# EAGLE board IR (EAGLE 9.5.2)
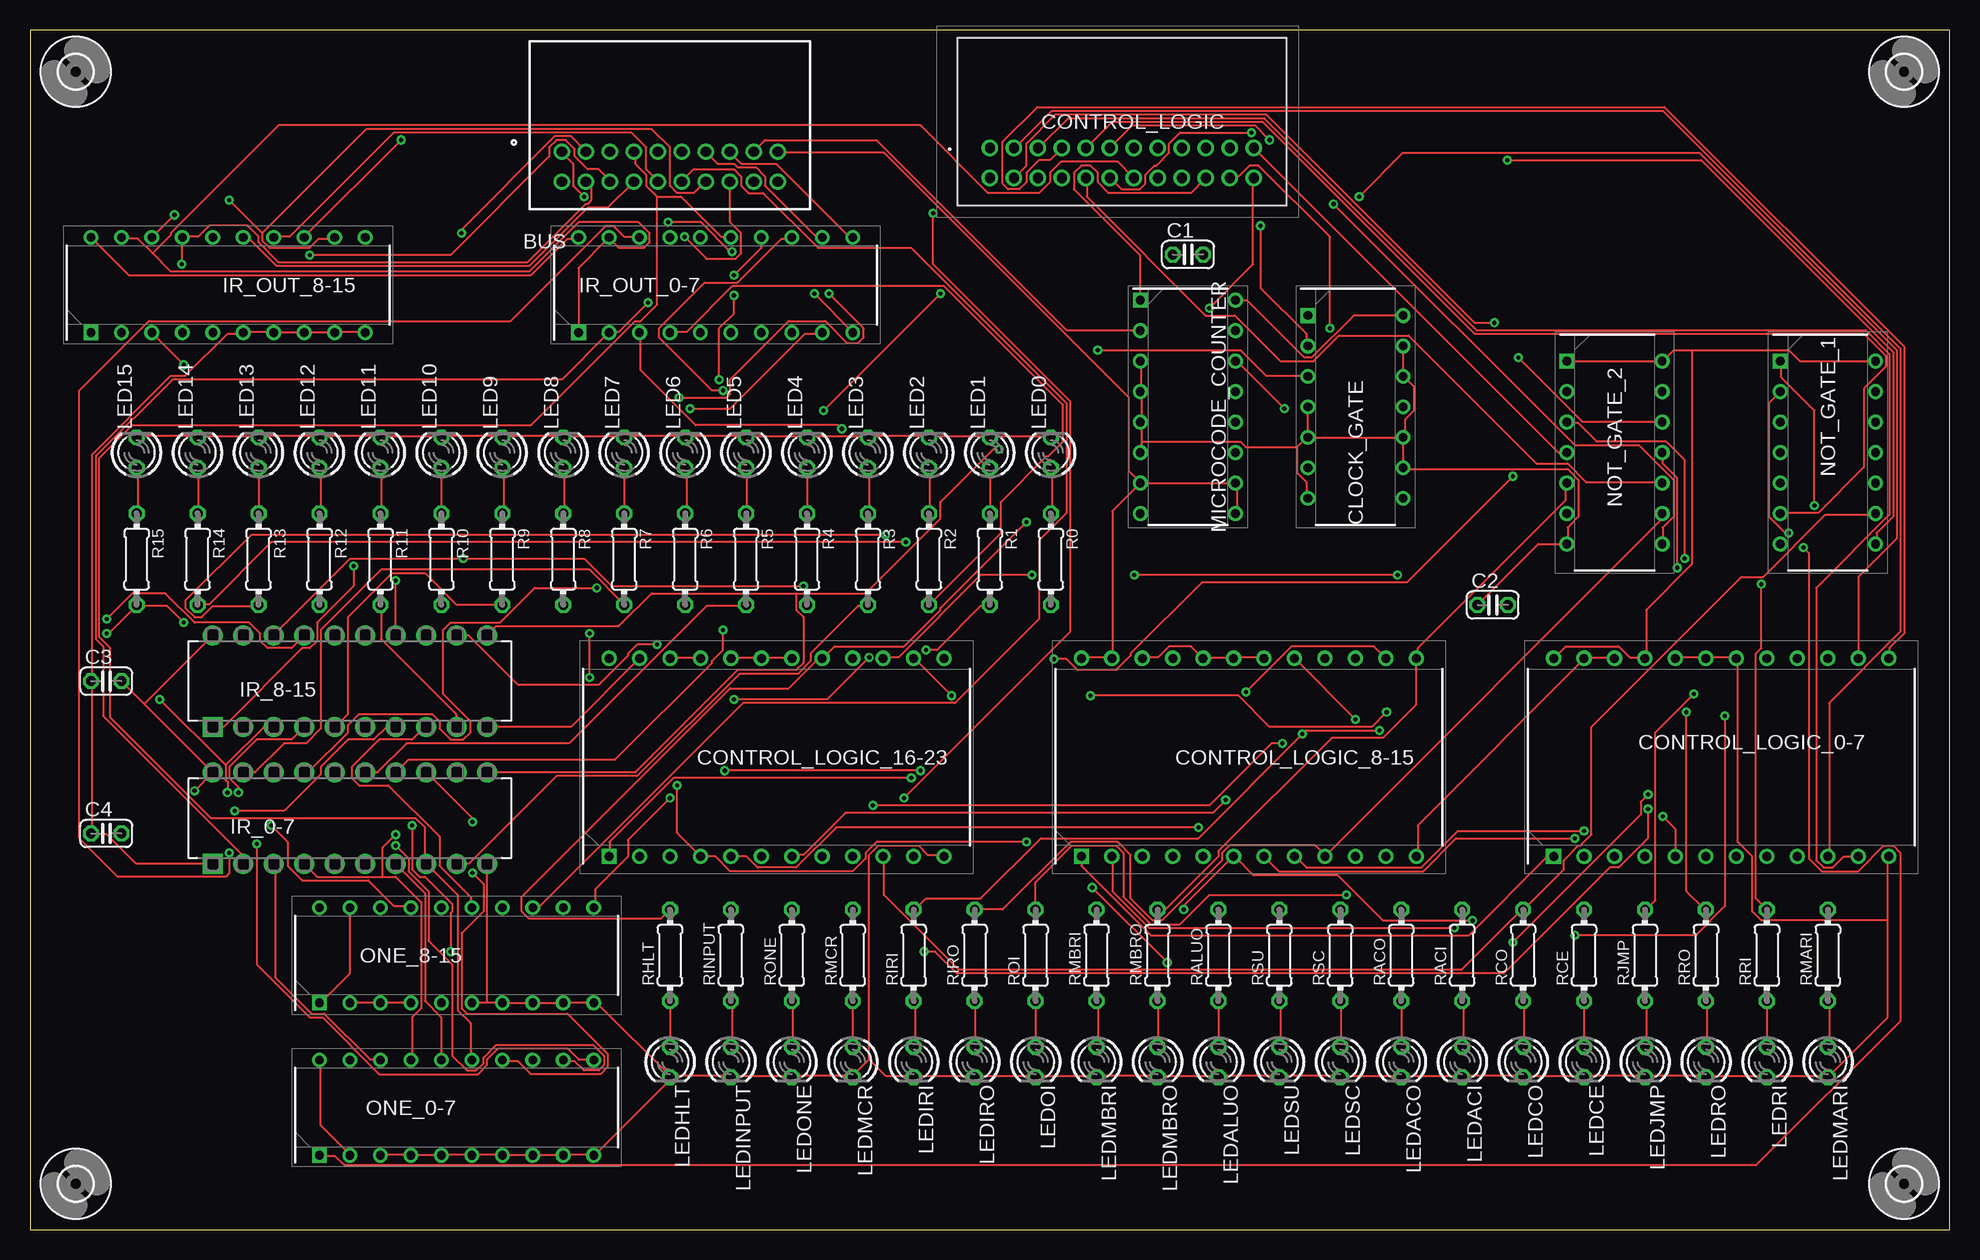
[diagram p1: board, top side]
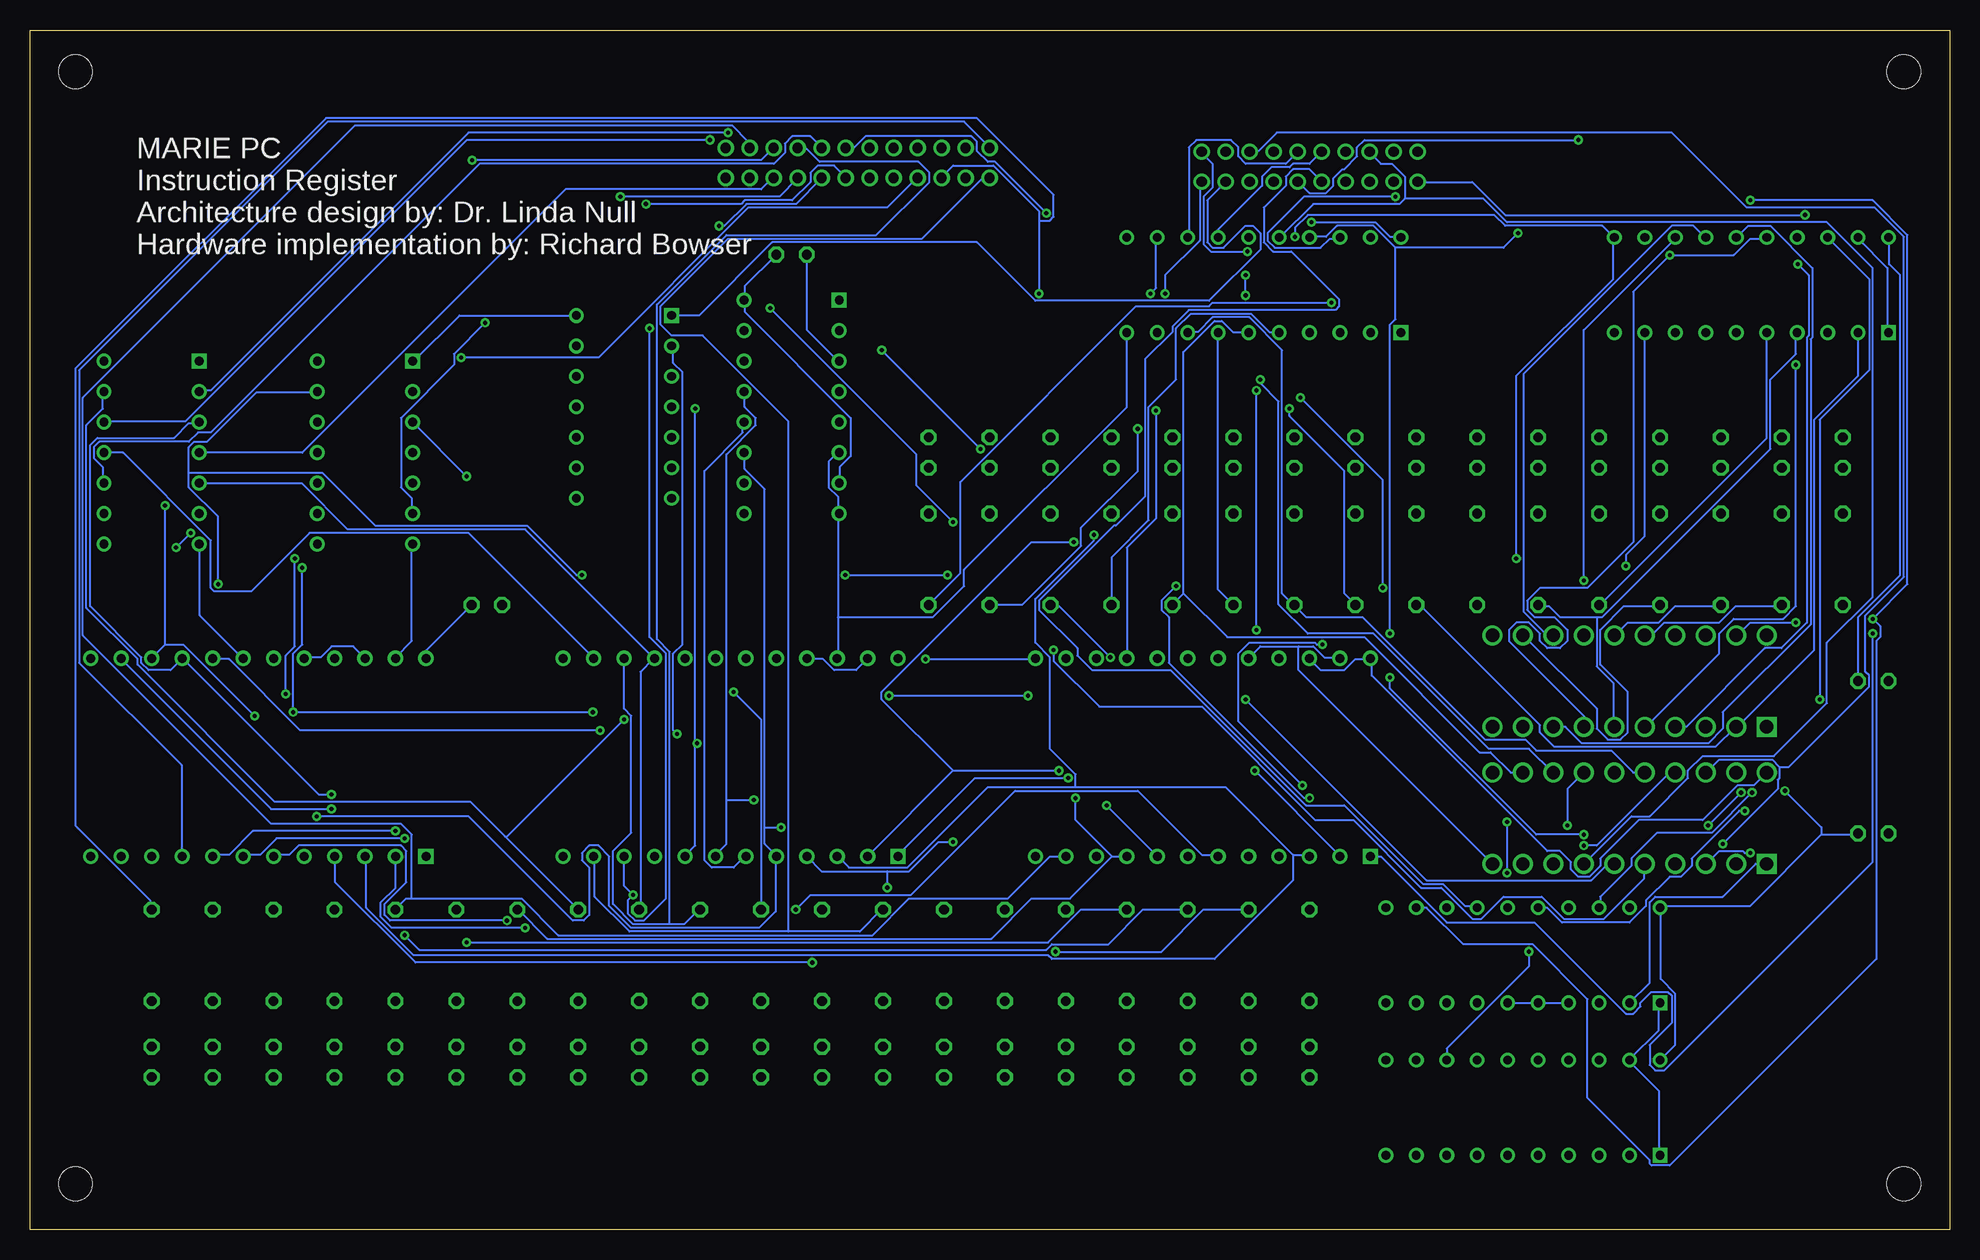
[diagram p2: board, bottom side, seen from below]

Size 160 x 100 mm. Coordinates in mm from the lower left corner, seen from the top.
Outline: 0,0 160,0 160,100 0,100 0,0
Copper layers (1*16): Top 0.035mm / dielectric 1.5mm / Bottom 0.035mm
Design rules "default": minimum track width 6mil, minimum drill 0.35mm, track to track 6mil, track to pad 6mil, pad to pad 6mil, via to via 6mil, smd to smd 6mil, copper to edge 40mil, drill to drill 6mil, minimum pad ring 10mil, minimum via ring 8mil, stop-mask expansion 4mil, vias tented up to drill 0mil, thermal gap 10mil

## Footprints (pad centres in the part's own frame; a part is rotated, then mirrored left to right if it is on the bottom)
55959-2030_1 = drill 0.85 pad 1.35: 1 -9,-9.2; 2 -9,-11.7; 3 -7,-9.2; 4 -7,-11.7; 5 -5,-9.2; 6 -5,-11.7; 7 -3,-9.2; 8 -3,-11.7; 9 -1,-9.2; 10 -1,-11.7; 11 1,-9.2; 12 1,-11.7; 13 3,-9.2; 14 3,-11.7; 15 5,-9.2; 16 5,-11.7; 17 7,-9.2; 18 7,-11.7; 19 9,-9.2; 20 9,-11.7
C025-024X044 = drill 0.813 octagon: 1 -1.27,0; 2 1.27,0
DIP794W53P254L1930H508Q14N = drill 0.73 pad 1.13 square: 1 -3.97,7.62 | drill 0.73 pad 1.13: 2 -3.97,5.08; 3 -3.97,2.54; 4 -3.97,0; 5 -3.97,-2.54; 6 -3.97,-5.08; 7 -3.97,-7.62; 8 3.97,-7.62; 9 3.97,-5.08; 10 3.97,-2.54; 11 3.97,0; 12 3.97,2.54; 13 3.97,5.08; 14 3.97,7.62
559592430 = drill 0.85 pad 1.381: 1 0,0; 2 0,-2.5; 3 2,0; 4 2,-2.5; 5 4,0; 6 4,-2.5; 7 6,0; 8 6,-2.5; 9 8,0; 10 8,-2.5; 11 10,0; 12 10,-2.5; 13 12,0; 14 12,-2.5; 15 14,0; 16 14,-2.5; 17 16,0; 18 16,-2.5; 19 18,0; 20 18,-2.5; 21 20,0; 22 20,-2.5; 23 22,0; 24 22,-2.5
DIP1651W55P254L3188H635Q24N = drill 0.75 pad 1.15 square: 1 -8.255,13.97 | drill 0.75 pad 1.15: 2 -8.255,11.43; 3 -8.255,8.89; 4 -8.255,6.35; 5 -8.255,3.81; 6 -8.255,1.27; 7 -8.255,-1.27; 8 -8.255,-3.81; 9 -8.255,-6.35; 10 -8.255,-8.89; 11 -8.255,-11.43; 12 -8.255,-13.97; 13 8.255,-13.97; 14 8.255,-11.43; 15 8.255,-8.89; 16 8.255,-6.35; 17 8.255,-3.81; 18 8.255,-1.27; 19 8.255,1.27; 20 8.255,3.81; 21 8.255,6.35; 22 8.255,8.89; 23 8.255,11.43; 24 8.255,13.97
DIP254P762X508-20 = drill 1.118 pad 1.676 square: 1 -7.62,22.86 | drill 1.118 pad 1.676: 2 -7.62,20.32; 3 -7.62,17.78; 4 -7.62,15.24; 5 -7.62,12.7; 6 -7.62,10.16; 7 -7.62,7.62; 8 -7.62,5.08; 9 -7.62,2.54; 10 -7.62,0; 11 0,0; 12 0,2.54; 13 0,5.08; 14 0,7.62; 15 0,10.16; 16 0,12.7; 17 0,15.24; 18 0,17.78; 19 0,20.32; 20 0,22.86
DIP794W53P254L2540H508Q20N = drill 0.73 pad 1.13 square: 1 -3.97,11.43 | drill 0.73 pad 1.13: 2 -3.97,8.89; 3 -3.97,6.35; 4 -3.97,3.81; 5 -3.97,1.27; 6 -3.97,-1.27; 7 -3.97,-3.81; 8 -3.97,-6.35; 9 -3.97,-8.89; 10 -3.97,-11.43; 11 3.97,-11.43; 12 3.97,-8.89; 13 3.97,-6.35; 14 3.97,-3.81; 15 3.97,-1.27; 16 3.97,1.27; 17 3.97,3.81; 18 3.97,6.35; 19 3.97,8.89; 20 3.97,11.43
LED3MM = drill 0.813 octagon: A -1.27,0; K 1.27,0
DIP794W53P254L1930H508Q16N = drill 0.73 pad 1.13 square: 1 -3.97,8.89 | drill 0.73 pad 1.13: 2 -3.97,6.35; 3 -3.97,3.81; 4 -3.97,1.27; 5 -3.97,-1.27; 6 -3.97,-3.81; 7 -3.97,-6.35; 8 -3.97,-8.89; 9 3.97,-8.89; 10 3.97,-6.35; 11 3.97,-3.81; 12 3.97,-1.27; 13 3.97,1.27; 14 3.97,3.81; 15 3.97,6.35; 16 3.97,8.89
0204/7 = drill 0.813 octagon: 1 -3.81,0; 2 3.81,0
2,8 = hole 2.8: 0,0

## Placement (x,y rotation side)
BUS  55959-2030  [55959-2030_1]  53.34,99.06 0 top
C1  [C025-024X044]  96.52,81.28 0 top
C2  [C025-024X044]  121.92,52.07 0 top
C3  [C025-024X044]  6.35,45.72 0 top
C4  [C025-024X044]  6.35,33.02 0 top
CLOCK_GATE  SN74HC08N  [DIP794W53P254L1930H508Q14N]  110.49,68.58 0 top
CONTROL_LOGIC  55959-2430  [559592430]  80.01,90.17 0 top
CONTROL_LOGIC_0-7  CAT28C16ALI-20  [DIP1651W55P254L3188H635Q24N]  140.97,39.37 90 top
CONTROL_LOGIC_8-15  CAT28C16ALI-20  [DIP1651W55P254L3188H635Q24N]  101.6,39.37 90 top
CONTROL_LOGIC_16-23  CAT28C16ALI-20  [DIP1651W55P254L3188H635Q24N]  62.23,39.37 90 top
IR_0-7  SN74BCT374N  [DIP254P762X508-20]  38.1,38.1 90 top
IR_8-15  SN74BCT374N  [DIP254P762X508-20]  38.1,49.53 90 top
IR_OUT_0-7  SN74HC541N  [DIP794W53P254L2540H508Q20N]  57.15,78.74 90 top
IR_OUT_8-15  SN74HC541N  [DIP794W53P254L2540H508Q20N]  16.51,78.74 90 top
LED0  YELLOW  [LED3MM]  85.09,64.77 90 top
LED1  YELLOW  [LED3MM]  80.01,64.77 90 top
LED2  YELLOW  [LED3MM]  74.93,64.77 90 top
LED3  YELLOW  [LED3MM]  69.85,64.77 90 top
LED4  YELLOW  [LED3MM]  64.77,64.77 90 top
LED5  YELLOW  [LED3MM]  59.69,64.77 90 top
LED6  YELLOW  [LED3MM]  54.61,64.77 90 top
LED7  YELLOW  [LED3MM]  49.53,64.77 90 top
LED8  YELLOW  [LED3MM]  44.45,64.77 90 top
LED9  YELLOW  [LED3MM]  39.37,64.77 90 top
LED10  YELLOW  [LED3MM]  34.29,64.77 90 top
LED11  YELLOW  [LED3MM]  29.21,64.77 90 top
LED12  BLUE  [LED3MM]  24.13,64.77 90 top
LED13  BLUE  [LED3MM]  19.05,64.77 90 top
LED14  BLUE  [LED3MM]  13.97,64.77 90 top
LED15  BLUE  [LED3MM]  8.89,64.77 90 top
LEDACI  BLUE  [LED3MM]  119.38,13.97 270 top
LEDACO  BLUE  [LED3MM]  114.3,13.97 270 top
LEDALUO  BLUE  [LED3MM]  99.06,13.97 270 top
LEDCE  BLUE  [LED3MM]  129.54,13.97 270 top
LEDCO  BLUE  [LED3MM]  124.46,13.97 270 top
LEDHLT  BLUE  [LED3MM]  53.34,13.97 270 top
LEDINPUT  BLUE  [LED3MM]  58.42,13.97 270 top
LEDIRI  BLUE  [LED3MM]  73.66,13.97 270 top
LEDIRO  BLUE  [LED3MM]  78.74,13.97 270 top
LEDJMP  BLUE  [LED3MM]  134.62,13.97 270 top
LEDMARI  BLUE  [LED3MM]  149.86,13.97 270 top
LEDMBRI  BLUE  [LED3MM]  88.9,13.97 270 top
LEDMBRO  BLUE  [LED3MM]  93.98,13.97 270 top
LEDMCR  BLUE  [LED3MM]  68.58,13.97 270 top
LEDOI  BLUE  [LED3MM]  83.82,13.97 270 top
LEDONE  BLUE  [LED3MM]  63.5,13.97 270 top
LEDRI  BLUE  [LED3MM]  144.78,13.97 270 top
LEDRO  BLUE  [LED3MM]  139.7,13.97 270 top
LEDSC  BLUE  [LED3MM]  109.22,13.97 270 top
LEDSU  BLUE  [LED3MM]  104.14,13.97 270 top
MICROCODE_COUNTER  SN74HC161N  [DIP794W53P254L1930H508Q16N]  96.52,68.58 0 top
NOT_GATE_1  SN74HC04N  [DIP794W53P254L1930H508Q14N]  149.86,64.77 0 top
NOT_GATE_2  SN74HC04N  [DIP794W53P254L1930H508Q14N]  132.08,64.77 0 top
ONE_0-7  SN74HC541N  [DIP794W53P254L2540H508Q20N]  35.56,10.16 90 top
ONE_8-15  SN74HC541N  [DIP794W53P254L2540H508Q20N]  35.56,22.86 90 top
R0  220  [0204/7]  85.09,55.88 270 top
R1  220  [0204/7]  80.01,55.88 270 top
R2  220  [0204/7]  74.93,55.88 270 top
R3  220  [0204/7]  69.85,55.88 270 top
R4  220  [0204/7]  64.77,55.88 270 top
R5  220  [0204/7]  59.69,55.88 270 top
R6  220  [0204/7]  54.61,55.88 270 top
R7  220  [0204/7]  49.53,55.88 270 top
R8  220  [0204/7]  44.45,55.88 270 top
R9  220  [0204/7]  39.37,55.88 270 top
R10  220  [0204/7]  34.29,55.88 270 top
R11  220  [0204/7]  29.21,55.88 270 top
R12  220  [0204/7]  24.13,55.88 270 top
R13  220  [0204/7]  19.05,55.88 270 top
R14  220  [0204/7]  13.97,55.88 270 top
R15  220  [0204/7]  8.89,55.88 270 top
RACI  220  [0204/7]  119.38,22.86 90 top
RACO  220  [0204/7]  114.3,22.86 90 top
RALUO  220  [0204/7]  99.06,22.86 90 top
RCE  220  [0204/7]  129.54,22.86 90 top
RCO  220  [0204/7]  124.46,22.86 90 top
RHLT  220  [0204/7]  53.34,22.86 90 top
RINPUT  220  [0204/7]  58.42,22.86 90 top
RIRI  220  [0204/7]  73.66,22.86 90 top
RIRO  220  [0204/7]  78.74,22.86 90 top
RJMP  220  [0204/7]  134.62,22.86 90 top
RMARI  220  [0204/7]  149.86,22.86 90 top
RMBRI  220  [0204/7]  88.9,22.86 90 top
RMBRO  220  [0204/7]  93.98,22.86 90 top
RMCR  220  [0204/7]  68.58,22.86 90 top
ROI  220  [0204/7]  83.82,22.86 90 top
RONE  220  [0204/7]  63.5,22.86 90 top
RRI  220  [0204/7]  144.78,22.86 90 top
RRO  220  [0204/7]  139.7,22.86 90 top
RSC  220  [0204/7]  109.22,22.86 90 top
RSU  220  [0204/7]  104.14,22.86 90 top
U$1  [2,8]  3.81,3.81 0 top
U$2  [2,8]  3.81,96.52 0 top
U$3  [2,8]  156.21,96.52 0 top
U$4  [2,8]  156.21,3.81 0 top

## Tracks (layer width: path | path; a pad name or v marks a point on that pad's centre or on a via)
!ACO  (via drill 0.35)
  Top 0.152: v103.33,90.83 102.11,92.05 91.9,92.05 90.07,90.22 CONTROL_LOGIC.11
  Bottom 0.152: v103.33,90.83 123.6,90.83 147.07,67.36 153.77,67.36 NOT_GATE_1.12
!ALUO
  Bottom 0.152: NOT_GATE_1.10 153.92,62.33 153.92,63.55 154.69,64.31 154.69,65.23 154.23,65.68 146.76,65.68 146,66.45 144.93,66.45 122.53,88.85 97.99,88.85 97.08,89.76 97.08,90.53 96.47,91.14 94.94,91.14 94.03,90.22 CONTROL_LOGIC.15
!CLK
  Top 0.152: MICROCODE_COUNTER.2 92.51,74.98 86.41,74.98 70.56,90.83 61.27,90.83 60.35,89.92 BUS.17
!CO  (via drill 0.35)
  Top 0.152: v123.14,89.15 139.29,89.15 155.3,73.15 155.3,59.44 153.92,58.06 153.92,57.15 NOT_GATE_1.8
  Bottom 0.152: v123.14,89.15 99.06,89.15 98.15,90.07 CONTROL_LOGIC.19
!IRO  (via drill 0.35)
  Top 0.152: IR_OUT_0-7.1 45.72,80.16 48.16,82.6 IR_OUT_0-7.19 48.31,82.6 49.07,81.84 51.21,81.84 51.66,82.3 51.66,83.06 50.75,83.97 45.72,83.97 41.6,79.86 11.73,79.86 10.21,81.38 | 10.21,81.38 8.99,82.6 7.62,82.6 IR_OUT_8-15.19 | v108.66,85.5 128.78,65.38 134.11,65.38 137.01,62.48 137.01,59.44 136.09,58.52 136.09,57.15 NOT_GATE_2.8 | 10.21,81.38 11.73,82.91 11.73,83.06 20.73,92.05 74.22,92.05 79.86,86.41 84.12,86.41 85.04,87.33 85.04,88.09 85.95,89 90.68,89 91.9,87.78 CONTROL_LOGIC.14
  Bottom 0.152: IR_OUT_8-15.1 5.18,74.83 5.18,80.16 7.62,82.6 IR_OUT_8-15.19 | v108.66,85.5 100.74,85.5 100.43,85.8 96.47,85.8 94.94,87.33 94.94,88.09 94.34,88.7 92.96,88.7 92.05,87.78 CONTROL_LOGIC.14
!JMP
  Top 0.152: NOT_GATE_2.4 127.41,64.77 102.11,90.07 CONTROL_LOGIC.23
!MBRO  (via drill 0.35)
  Top 0.152: v122.07,75.59 120.4,75.59 103.02,92.96 85.5,92.96 83.06,90.53 83.06,88.7 82.14,87.78 CONTROL_LOGIC.4
  Bottom 0.152: v122.07,75.59 124.66,73 124.66,72.08 129.08,67.67 129.08,61.87 128.17,60.96 128.17,59.74 NOT_GATE_2.6
!MCR
  Top 0.152: MICROCODE_COUNTER.1 92.51,77.57 92.51,81.23 87.02,86.72 87.02,88.09 87.63,88.7 88.39,88.7 89,88.09 89,87.33 89.92,86.41 96.77,86.41 97.99,87.63 CONTROL_LOGIC.20
  Bottom 0.152: NOT_GATE_1.4 137.31,64.77 115.37,86.72 99.06,86.72 98.15,87.63 CONTROL_LOGIC.20
!ONE  (via drill 0.35)
  Top 0.152: ONE_8-15.19 26.67,21.34 24.23,18.9 ONE_8-15.1 | v101.8,91.44 95.86,91.44 94.94,90.53 94.94,89.76 93.88,88.7 93.73,88.7 92.96,87.94 92.96,87.17 92.51,86.72 90.98,86.72 90.07,87.63 CONTROL_LOGIC.12 | v147.83,56.84 148.28,56.39 148.28,30.94 149.35,29.87 152.4,29.87 154.53,32 155.3,32 155.91,31.39 155.91,17.37 143.87,5.33 26.21,5.33 25.45,6.1 24.23,6.1 ONE_0-7.1 | v146.61,58.06 146.3,58.06 144.93,59.44 144.93,68.89 145.85,69.8 NOT_GATE_1.2
  Bottom 0.152: ONE_0-7.1 24.23,6.25 24.23,11.58 26.67,14.02 ONE_0-7.19 26.67,14.17 24.23,16.61 24.23,18.75 ONE_8-15.1 | v101.8,91.44 123.44,91.44 144.93,69.95 145.85,69.95 NOT_GATE_1.2 | v146.61,58.06 v147.83,56.84
!RI  (via drill 0.35)
  Top 0.152: v124.05,72.69 129.39,67.36 135.94,67.36 NOT_GATE_2.12
  Bottom 0.152: v124.05,72.69 112.62,72.69 100.13,85.19 88.54,85.19 86.11,87.63 CONTROL_LOGIC.8
!RO
  Top 0.152: NOT_GATE_2.10 135.94,62.33 129.69,62.33 128.17,63.86 125.58,63.86 114.91,74.52 109.12,74.52 106.98,72.39 104.24,72.39 100.43,76.2 97.99,76.2 88.09,86.11 88.09,87.63 CONTROL_LOGIC.10
!SC
  Top 0.152: NOT_GATE_1.6 146,59.74 149.05,59.74 152.86,63.55 152.86,70.1 154.69,71.93 154.69,72.85 152.86,74.68 120.4,74.68 102.72,92.35 90.22,92.35 88.09,90.22 CONTROL_LOGIC.9
ACI  (via drill 0.35)
  Top 0.152: v75.29,84.73 75.29,80.47 86.72,69.04 86.72,49.84 v72.85,35.97
  Bottom 0.152: 69.8,31.09 68.58,31.09 CONTROL_LOGIC_16-23.9 | 69.8,31.09 73.3,27.58 76.5,27.58 79.86,24.23 116.89,24.23 119.33,26.67 RACI.2 | v75.29,84.73 79.55,89 80.16,89 81.08,89.92 81.08,90.68 81.53,91.14 90.37,91.14 91.29,90.22 91.9,90.22 CONTROL_LOGIC.13 | v72.85,35.97 72.85,34.14 69.8,31.09
ACO  (via drill 0.35)
  Top 0.152: v110.49,42.52 105.46,47.55 CONTROL_LOGIC_8-15.17
  Bottom 0.152: RACO.2 120.4,32.77 | 120.4,32.77 123.29,35.66 139.6,35.66 151.03,47.09 151.03,47.55 155.3,51.82 155.3,67.06 153.92,68.43 153.92,69.8 NOT_GATE_1.13 | v110.49,42.52 120.24,32.77 120.4,32.77
ALUO  (via drill 0.35)
  Top 0.152: v101.35,44.81 105.16,48.62 112.01,48.62 112.93,47.7 CONTROL_LOGIC_8-15.14
  Bottom 0.152: NOT_GATE_1.11 152.25,64.77 144.93,57.45 144.93,53.49 144.63,53.19 141.58,53.19 136.7,58.06 123.44,58.06 113.08,47.7 CONTROL_LOGIC_8-15.14 | RALUO.2 99.06,42.52 v101.35,44.81
B0  (via drill 0.35)
  Top 0.152: v46.18,86.11 45.26,87.02 45.26,88.85 44.35,89.76 BUS.1 | ONE_0-7.18 29.11,14.17 28.35,14.17 24.54,17.98 23.47,17.98 20.42,21.03 20.42,30.48 IR_0-7.3 | v16.61,31.39 16.61,29.72 16.31,29.41 7.32,29.41 4.12,32.61 4.12,69.95 9.91,75.74 40.08,75.74 48.01,83.67 48.62,83.67 49.53,82.75 50.75,82.75 IR_OUT_0-7.18
  Bottom 0.152: v46.18,86.11 53.8,86.11 56.84,83.06 56.84,82.45 56.24,81.84 52.43,81.84 51.66,82.6 50.9,82.6 IR_OUT_0-7.18 | v16.61,31.39 17.07,31.39 17.22,31.55 19.2,31.55 20.27,30.48 IR_0-7.3
B1  (via drill 0.35)
  Top 0.152: v35.97,83.06 35.97,83.36 43.74,91.14 45.11,91.14 46.33,89.92 BUS.3 | 29.41,29.41 23.93,29.41 IR_0-7.4 | 29.41,29.41 30.48,29.41 32.61,27.28 32.61,18.44 31.85,17.68 31.85,14.17 ONE_0-7.17 | v46.63,46.02 v46.63,49.68 | v30.48,32.92 29.41,31.85 29.41,29.41
  Bottom 0.152: 46.18,81.84 48.01,83.67 51.05,83.67 51.97,82.75 53.34,82.75 IR_OUT_0-7.17 | 46.18,81.84 37.19,81.84 v35.97,83.06 | 46.18,81.84 46.18,75.89 46.63,75.44 v46.63,49.68 | v46.63,46.02 46.63,45.11 34.44,32.92 v30.48,32.92
B2
  Top 0.152: ONE_0-7.16 34.29,17.68 32.92,19.05 32.92,28.04 IR_0-7.7
  Bottom 0.152: 45.41,85.95 45.87,85.5 53.03,85.5 55.78,82.75 IR_OUT_0-7.16 | 45.41,85.95 45.41,87.78 46.48,88.85 47.4,88.85 48.31,89.76 BUS.5 | 45.41,85.95 38.86,85.95 36.88,83.97 10.21,83.97 6.4,80.16 6.4,52.73 10.21,48.92 10.21,43.89 14.63,39.47 20.57,39.47 21.79,38.25 21.79,37.64 24.99,34.44 26.52,34.44 IR_0-7.7
B3
  Top 0.152: 52.27,86.11 54.25,86.11 57.61,82.75 58.37,82.75 IR_OUT_0-7.15 | 52.27,86.11 51.36,87.02 51.36,87.94 50.44,88.85 50.44,89.76 BUS.7 | ONE_0-7.15 36.73,14.17 36.73,17.22 35.66,18.29 35.66,27.89 33.07,30.48 IR_0-7.8 32.92,30.48 32.92,33.53 32.16,34.29 15.09,34.29 6.71,42.67 6.71,48.46 5.79,49.38 5.79,64.31 8.53,67.06 41.76,67.06 50.44,75.74 50.9,75.74 52.27,77.11 52.27,86.11
B4  (via drill 0.35)
  Top 0.152: v36.88,29.72 37.8,28.8 37.8,26.52 35.97,24.69 35.97,18.44 36.42,17.98 44.81,17.98 48.16,14.63 48.16,13.56 47.55,12.95 41.76,12.95 40.69,14.02 39.47,14.02 ONE_0-7.14 | v36.88,33.98 36.88,34.29 33.07,38.1 IR_0-7.13 | IR_OUT_0-7.14 60.96,81.84 v58.67,79.55 | v58.67,77.88 58.67,76.35 57.45,75.13 v57.45,70.87
  Bottom 0.152: IR_OUT_0-7.14 60.96,83.36 57.3,87.02 57.3,87.78 56.54,88.54 55.02,88.54 54.71,88.85 53.34,88.85 52.43,89.76 BUS.9 | v36.88,33.98 v36.88,29.72 | v58.67,77.88 v58.67,79.55 | v57.45,70.87 57.45,70.56 55.93,69.04 55.93,52.12 53.49,49.68 48.01,49.68 38.41,40.08 35.05,40.08 33.07,38.1 IR_0-7.13
B5  (via drill 0.35)
  Top 0.152: v35.05,23.16 35.05,26.36 35.2,26.52 35.2,27.13 32.92,29.41 32.46,29.41 31.85,30.02 v31.85,33.68 | v57.76,69.95 56.84,69.95 52.43,74.37 52.43,75.13 56.24,78.94 58.98,78.94 62.64,82.6 63.4,82.6 IR_OUT_0-7.13 | v57.76,49.99 57.76,48.31 56.84,47.4 56.84,47.24 48.77,39.17 31.55,39.17 IR_0-7.14
  Bottom 0.152: IR_OUT_0-7.13 63.4,82.75 63.4,90.22 62.79,90.83 59.89,90.83 59.28,90.22 59.28,89.46 58.67,88.85 55.32,88.85 54.41,89.76 BUS.11 | ONE_0-7.13 41.91,15.09 35.05,21.95 v35.05,23.16 | v31.85,33.68 31.85,36.73 IR_0-7.14 | v57.76,49.99 v57.76,69.95
B6  (via drill 0.35)
  Top 0.152: IR_OUT_0-7.12 65.99,82.75 65.53,82.75 61.27,87.02 61.27,87.78 60.5,88.54 58.98,88.54 58.67,88.85 57.3,88.85 56.39,89.76 BUS.13 | v30.48,32 31.55,30.94 31.55,29.87 33.22,28.19 33.22,24.08 35.2,22.1 35.2,14.48 36.42,13.26 37.19,13.26 37.8,13.87 37.8,14.33 38.86,15.39 46.94,15.39 47.85,14.48 47.85,13.72 47.4,13.26 46.18,13.26 45.41,14.02 44.5,14.02 ONE_0-7.12 | v66.6,78.03 69.49,75.13 69.49,74.37 69.04,73.91 68.12,73.91 66.29,75.74 63.25,75.74 58.37,70.87 58.37,69.65 58.06,69.34 v54.1,69.34 | v47.24,53.49 42.06,53.49 39.17,50.6 35.05,50.6 34.44,49.99 34.44,44.65 36.73,42.37 36.73,41.45 36.12,40.84 35.05,40.84 34.14,41.76 34.14,42.37 33.53,42.98 27.43,42.98 26.52,42.06 26.52,41.45 23.16,38.1 IR_0-7.17
  Bottom 0.152: v30.48,32 29.41,32 23.32,38.1 IR_0-7.17 | v66.6,78.03 66.14,78.49 66.14,82.6 IR_OUT_0-7.12 | v54.1,69.34 47.24,62.48 v47.24,53.49
B7  (via drill 0.35)
  Top 0.152: IR_OUT_0-7.11 68.58,82.75 68.28,82.75 62.18,88.85 59.28,88.85 58.37,89.76 BUS.15 | v18.9,32.16 18.9,22.1 23.32,17.68 24.38,17.68 29.11,12.95 37.34,12.95 38.1,13.72 38.1,14.17 39.01,15.09 44.81,15.09 45.72,14.17 46.94,14.17 ONE_0-7.11
  Bottom 0.152: v18.9,32.16 14.33,36.73 14.33,37.49 14.17,37.64 14.17,38.56 | 14.17,38.56 14.78,39.17 19.2,39.17 20.27,38.1 IR_0-7.18 | 14.17,38.56 13.41,38.56 6.71,45.26 6.71,46.18 7.01,46.48 7.01,51.21 3.81,54.41 3.81,82.75 6.25,85.19 16.92,85.19 23.16,91.44 56.08,91.44 57.61,89.92 58.22,89.92 BUS.15
B8  (via drill 0.35)
  Top 0.152: v16.46,36.42 16.46,37.34 16.31,37.49 16.31,38.71 | 16.31,38.71 19.51,41.91 IR_8-15.3 | v12.04,84.58 10.21,82.75 IR_OUT_8-15.18 | v10.82,44.2 16.31,38.71
  Bottom 0.152: v16.46,36.42 19.81,33.07 24.38,33.07 26.52,30.94 26.52,30.33 29.11,27.74 29.11,26.98 ONE_8-15.18 | v12.04,84.58 37.03,84.58 39.78,87.33 44.2,87.33 BUS.2 | v10.82,44.2 10.82,67.51 6.71,71.63 6.71,79.25 10.06,82.6 IR_OUT_8-15.18
B9  (via drill 0.35)
  Top 0.152: v20.12,33.68 21.49,32.31 21.49,30.33 22.71,29.11 28.19,29.11 30.33,26.98 31.7,26.98 ONE_8-15.17 | v17.37,36.42 17.37,36.88 16.61,37.64 16.61,38.56 18.9,40.84 21.79,40.84 IR_8-15.4 | BUS.4 46.48,87.33 46.79,87.02 46.79,85.8 46.48,85.5 46.33,85.5 41.45,80.62 20.73,80.62 19.05,82.3 19.05,82.75 18.14,83.67 14.94,83.67 14.02,82.75 12.8,82.75 IR_OUT_8-15.17 12.65,82.6 v12.65,80.47
  Bottom 0.152: v17.37,36.42 v20.12,33.68 | IR_8-15.4 21.95,41.91 15.39,48.46 14.02,48.46 11.89,50.6 11.89,74.37 11.73,74.52 11.73,79.55 v12.65,80.47
B10  (via drill 0.35)
  Top 0.152: v17.07,34.9 21.18,34.9 24.23,37.95 24.23,38.56 26.52,40.84 28.65,40.84 29.72,41.91 IR_8-15.7 | v23.32,81.23 35.05,81.23 43.28,89.46 43.28,90.22 43.89,90.83 44.65,90.83 45.41,90.07 45.41,89.46 46.48,88.39 47.4,88.39 48.31,87.48 BUS.6
  Bottom 0.152: v17.07,34.9 17.53,34.9 21.49,30.94 21.49,30.33 22.4,29.41 23.32,29.41 25.3,27.43 25.3,26.98 26.67,25.6 32.31,25.6 33.53,26.82 ONE_8-15.16 | IR_OUT_8-15.16 15.24,82.6 16.61,82.6 17.98,81.23 v23.32,81.23 26.36,78.18 26.36,57.3 30.18,53.49 34.14,53.49 35.2,52.43 35.2,51.66 34.59,51.05 32.92,51.05 31.85,49.99 31.85,49.07 32.46,48.46 33.53,48.46 34.14,49.07 34.14,49.68 35.05,50.6 36.12,50.6 36.73,49.99 36.73,49.07 30.48,42.82 IR_8-15.7
B11
  Top 0.152: ONE_8-15.15 36.73,26.98 36.73,27.74 34.14,30.33 34.14,32.77 29.87,37.03 27.43,37.03 26.82,37.64 26.82,38.56 29.11,40.84 31.85,40.84 32.92,41.91 IR_8-15.8 | IR_OUT_8-15.15 17.83,82.6 18.29,82.6 20.57,80.31 41.6,80.31 46.48,85.19 48.16,85.19 50.29,87.33 BUS.8
  Bottom 0.152: IR_8-15.8 32,41.91 30.63,40.54 20.12,40.54 18.9,41.76 18.9,43.13 11.58,50.44 11.58,74.22 11.43,74.37 11.43,80.16 14.94,83.67 16.76,83.67 17.68,82.75 IR_OUT_8-15.15
B12
  Top 0.152: IR_OUT_8-15.14 20.42,82.75 21.64,82.75 30.33,91.44 50.14,91.44 51.36,90.22 51.36,88.39 52.27,87.48 BUS.10
  Bottom 0.152: ONE_8-15.14 39.47,26.98 40.39,26.98 42.22,28.8 43.89,28.8 50.44,35.36 53.65,35.36 64.92,46.63 71.48,46.63 72.69,47.85 72.69,48.46 75.89,51.66 75.89,52.43 69.65,58.67 69.49,58.67 67.06,61.11 67.06,72.54 64.77,74.83 64.77,75.29 63.4,76.66 51.21,76.66 50.9,76.96 50.9,77.57 54.86,81.53 56.39,81.53 57.15,82.3 57.15,85.19 55.32,87.02 55.32,87.78 54.71,88.39 53.34,88.39 52.43,87.48 BUS.10 | IR_8-15.13 33.53,49.53 35.51,51.51 35.51,71.32 23.16,83.67 21.34,83.67 20.42,82.75 IR_OUT_8-15.14
B13  (via drill 0.35)
  Top 0.152: IR_8-15.14 v30.48,54.1 | ONE_8-15.13 41.91,26.98 42.52,26.98 59.44,43.89 77.11,43.89 84.12,50.9 84.12,57.45 86.41,59.74 86.41,68.89 73.46,81.84 65.68,81.84 61.11,86.41 59.89,86.41 59.28,87.02 59.28,87.78 58.67,88.39 55.32,88.39 54.41,87.48 BUS.12 | v30.94,90.83 22.86,82.75 IR_OUT_8-15.13
  Bottom 0.152: v30.48,54.1 30.48,74.98 22.86,82.6 IR_OUT_8-15.13 | v30.94,90.83 48.77,90.83 49.38,90.22 49.38,89.46 50.44,88.39 50.6,88.39 51.36,87.63 51.36,87.02 51.97,86.41 53.34,86.41 54.25,87.33 BUS.12
B14  (via drill 0.35)
  Top 0.152: 19.36,83.06 19.36,82.45 19.96,81.84 23.32,81.84 24.08,82.6 25.3,82.6 IR_OUT_8-15.12 | 19.36,83.06 28.04,91.75 51.82,91.75 53.34,90.22 53.34,87.02 53.95,86.41 55.32,86.41 56.24,87.33 BUS.14 | v6.4,50.9 8.53,53.03 11.28,53.03 13.72,50.6 18.29,50.6 19.2,49.68 19.2,49.07 19.81,48.46 21.79,48.46 IR_8-15.17 | v16.61,85.8 19.36,83.06
  Bottom 0.152: ONE_8-15.12 44.35,26.82 43.59,26.82 40.54,23.77 34.75,23.77 30.18,19.2 30.18,10.97 24.99,5.79 24.99,5.49 24.84,5.33 23.32,5.33 6.1,22.55 6.1,49.07 5.79,49.38 5.79,50.29 v6.4,50.9 3.5,53.8 3.5,82.91 6.4,85.8 v16.61,85.8
B15  (via drill 0.35)
  Top 0.152: v53.34,35.97 49.84,32.46 49.84,31.09 47.09,28.35 47.09,26.98 ONE_8-15.11 | v64.47,53.65 48.46,53.65 46.18,55.93 v36.12,55.93 26.67,55.93 20.27,49.53 IR_8-15.18 | v54.56,82.75 56.39,80.92 58.83,80.92 59.28,81.38 59.28,83.06 58.37,83.97 58.37,87.33 BUS.16
  Bottom 0.152: v53.34,35.97 53.8,35.97 65.08,47.24 65.08,51.05 65.68,51.66 65.68,52.43 v64.47,53.65 | v36.12,55.93 36.12,71.17 28.04,79.25 28.04,82.6 IR_OUT_8-15.11 28.04,82.75 28.96,83.67 37.03,83.67 37.95,84.58 53.49,84.58 54.56,83.52 v54.56,82.75
C0
  Bottom 0.152: CONTROL_LOGIC_0-7.9 147.37,31.24 147.37,38.71 155.91,47.24 155.91,71.63 135.18,92.35 82.14,92.35 80.01,90.22 CONTROL_LOGIC.1
C1
  Top 0.152: CONTROL_LOGIC_0-7.10 149.96,31.24 149.96,43.89 155.91,49.84 155.91,73.46 136.09,93.27 85.19,93.27 82.14,90.22 CONTROL_LOGIC.3
C2
  Top 0.152: CONTROL_LOGIC_0-7.11 152.4,31.09 151.18,31.09 150.27,30.18 149.5,30.18 148.9,30.79 148.9,53.49 154.99,59.59 154.99,73 153.01,74.98 120.55,74.98 102.87,92.66 86.56,92.66 84.12,90.22 CONTROL_LOGIC.5
C3
  Top 0.152: CONTROL_LOGIC_0-7.13 154.99,47.7 154.99,48.46 156.21,49.68 156.21,73.61 136.25,93.57 83.97,93.57 81.08,90.68 81.08,87.17 81.53,86.72 82.45,86.72 83.06,87.33 83.06,88.09 84.12,89.15 85.04,89.15 85.95,90.07 CONTROL_LOGIC.7
CE
  Bottom 0.152: 128.17,27.58 128.63,27.58 RCE.2 | 128.17,27.58 119.02,27.58 115.98,24.54 89.76,24.54 86.72,27.58 78.49,27.58 74.98,31.09 73.76,31.09 CONTROL_LOGIC_16-23.11 | 128.17,27.58 128.17,32.92 129.08,33.83 139.9,33.83 155.6,49.53 155.6,69.34 132.89,92.05 101.5,92.05 100.13,90.68 100.13,90.22 CONTROL_LOGIC.21
CLK
  Bottom 0.152: CLOCK_GATE.1 104.24,76.2 98.15,82.3 81.08,82.3 76.2,77.42 61.72,77.42 57.45,81.69 57.45,83.06 58.06,83.67 58.67,83.67 60.5,81.84 61.42,81.84 61.87,82.3 61.87,85.8 60.35,87.33 BUS.18
CO
  Top 0.152: NOT_GATE_1.9 153.77,59.59 149.66,59.59 144.47,54.41 142.65,54.41 130.15,41.91 130.15,32.92 129.24,32 129.08,32 127.86,30.79 127.86,30.02 124.51,26.67 RCO.2 124.36,26.67 119.33,21.64 77.42,21.64 71.17,27.89 71.17,31.09 CONTROL_LOGIC_16-23.10
GND  (via drill 0.35)
  Top 0.152: CONTROL_LOGIC_0-7.20 137.16,47.7 139.6,47.7 CONTROL_LOGIC_0-7.19 139.75,47.7 142.19,47.7 CONTROL_LOGIC_0-7.18 142.34,47.55 142.34,32.31 143.56,31.09 143.56,26.52 144.32,25.76 154.84,25.76 | C2.1 125.73,57.15 NOT_GATE_2.7 128.17,57.15 128.17,58.52 129.08,59.44 129.08,62.48 128.17,63.4 114.61,63.4 CLOCK_GATE.9 114.45,63.55 114.45,65.99 | CONTROL_LOGIC_8-15.12 115.67,31.24 115.67,33.68 129.54,47.55 CONTROL_LOGIC_0-7.23 129.54,47.7 131.98,47.7 CONTROL_LOGIC_0-7.22 | 105.61,65.23 105.61,63.09 106.38,62.33 106.38,60.96 CLOCK_GATE.7 | 105.61,65.23 106.38,65.99 CLOCK_GATE.5 | CLOCK_GATE.4 106.53,66.14 CLOCK_GATE.5 | CLOCK_GATE.13 114.45,73.61 114.45,71.17 CLOCK_GATE.12 114.61,71.02 115.37,70.26 115.37,68.28 114.61,67.51 114.61,66.14 CLOCK_GATE.10 114.45,65.99 | 114.45,65.99 106.53,65.99 CLOCK_GATE.5 | v65.38,78.03 68.58,74.83 IR_OUT_0-7.10 | CONTROL_LOGIC_8-15.18 102.87,47.7 100.43,47.7 CONTROL_LOGIC_8-15.19 100.28,47.7 97.84,47.7 CONTROL_LOGIC_8-15.20 97.69,47.7 96.77,48.62 94.94,48.62 94.03,47.7 92.81,47.7 CONTROL_LOGIC_8-15.22 | MICROCODE_COUNTER.3 92.66,72.39 92.66,69.95 MICROCODE_COUNTER.4 92.66,69.8 92.66,67.36 MICROCODE_COUNTER.5 92.66,67.21 92.66,65.68 | 92.66,65.68 92.66,64.77 MICROCODE_COUNTER.6 | 105.61,65.23 101.35,65.23 100.89,65.68 92.66,65.68 | IR_OUT_8-15.10 27.89,74.83 25.45,74.83 IR_OUT_8-15.9 25.3,74.83 22.86,74.83 | 22.86,74.83 20.42,74.83 IR_OUT_8-15.7 20.27,74.83 17.83,74.83 IR_OUT_8-15.6 17.68,74.68 16.46,74.68 12.95,71.17 11.73,71.17 5.18,64.62 5.18,45.72 | 22.86,74.83 IR_OUT_8-15.8 | IR_8-15.1 16.15,41.91 22.71,48.46 23.32,48.46 23.93,49.07 23.93,50.6 26.98,53.65 v26.98,55.32
  Top 0.152: 60.96,47.7 58.52,47.7 CONTROL_LOGIC_16-23.20 | 60.96,47.7 63.4,47.7 CONTROL_LOGIC_16-23.18 | 60.96,47.7 CONTROL_LOGIC_16-23.19 | IR_8-15.10 45.11,41.91 50.75,47.55 CONTROL_LOGIC_16-23.23 | IR_0-7.1 8.84,30.48 6.4,32.92 5.18,32.92 C4.1 5.18,33.07 5.18,45.72 | ONE_8-15.2 29.11,18.9 ONE_8-15.3 29.26,18.9 31.7,18.9 ONE_8-15.4 | 38.1,18.9 39.32,18.9 ONE_8-15.7 39.47,18.9 ONE_8-15.8 | 38.1,18.9 36.88,18.9 ONE_8-15.6 | ONE_8-15.8 44.35,18.9 ONE_8-15.9 44.5,18.9 46.94,18.9 ONE_8-15.10 47.09,18.75 47.4,18.75 53.34,12.8 | ONE_8-15.8 | 38.1,18.9 IR_0-7.10 | 5.18,45.72 C3.1 | 154.84,25.76 154.84,17.68 LEDMARI.K 149.81,12.8 144.78,12.8 | 154.84,25.76 154.84,31.09 CONTROL_LOGIC_0-7.12 | 129.54,12.8 124.51,12.8 LEDCO.K 124.36,12.8 119.48,12.8 LEDACI.K 119.33,12.8 114.3,12.8 | 144.78,12.8 139.75,12.8 LEDRO.K 139.6,12.8 134.72,12.8 LEDJMP.K 134.57,12.8 129.54,12.8 | 129.54,12.8 LEDCE.K | 144.78,12.8 LEDRI.K | 99.06,12.8 94.03,12.8 LEDMBRO.K 93.88,12.8 89,12.8 LEDMBRI.K 88.85,12.8 83.82,12.8 | 114.3,12.8 109.27,12.8 LEDSC.K 109.12,12.8 104.24,12.8 LEDSU.K 104.09,12.8 99.06,12.8 | 99.06,12.8 LEDALUO.K | ONE_0-7.3 29.26,6.25 31.7,6.25 ONE_0-7.4 31.85,6.25 34.29,6.25 | 41.91,6.25 39.47,6.25 ONE_0-7.7 39.32,6.25 36.88,6.25 ONE_0-7.6 36.73,6.25 34.29,6.25 | 41.91,6.25 44.35,6.25 ONE_0-7.9 44.5,6.25 46.94,6.25 ONE_0-7.10 47.09,6.25 53.34,12.5 LEDHLT.K 53.34,12.8 | 41.91,6.25 ONE_0-7.8 | 34.29,6.25 ONE_0-7.5 | 53.34,12.8 58.37,12.8 LEDINPUT.K 58.52,12.8 63.4,12.8 LEDONE.K 63.55,12.8 68.58,12.8 | 69.95,14.17 69.95,31.24 70.71,32 74.07,32 74.83,31.24 76.2,31.24 CONTROL_LOGIC_16-23.12
  Top 0.152: 68.58,12.8 69.95,14.17 | 69.95,14.17 71.32,12.8 73.61,12.8 LEDIRI.K 73.76,12.8 78.64,12.8 LEDIRO.K 78.79,12.8 83.82,12.8 | 68.58,12.8 LEDMCR.K | 83.82,12.8 LEDOI.K | 114.3,12.8 LEDACO.K
  Bottom 0.152: NOT_GATE_1.7 145.85,57.15 145.85,51.21 142.34,47.7 CONTROL_LOGIC_0-7.18 | NOT_GATE_2.7 128.17,57.15 128.17,49.07 129.54,47.7 CONTROL_LOGIC_0-7.23 | CONTROL_LOGIC_0-7.20 137.16,47.7 135.79,47.7 134.87,48.62 133.04,48.62 132.13,47.7 CONTROL_LOGIC_0-7.22 | v65.38,78.03 65.38,79.55 62.48,82.45 62.48,87.33 BUS.20 | MICROCODE_COUNTER.6 92.66,64.77 93.42,64.01 93.42,61.87 92.66,61.11 92.66,59.74 MICROCODE_COUNTER.8 92.66,59.59 92.66,51.05 | C1.1 95.25,74.98 92.66,72.39 MICROCODE_COUNTER.3 | 92.66,51.05 92.66,47.7 CONTROL_LOGIC_8-15.22 | IR_OUT_0-7.10 68.58,68.58 82.14,55.02 82.14,53.65 84.73,51.05 92.66,51.05 | v26.98,55.32 26.98,56.24 25.45,57.76 25.45,74.68 IR_OUT_8-15.9 | 54.25,48.62 57.45,48.62 58.37,47.7 CONTROL_LOGIC_16-23.20 | 54.25,48.62 53.03,48.62 52.12,47.7 50.9,47.7 CONTROL_LOGIC_16-23.23 | ONE_8-15.5 31.85,18.9 ONE_8-15.4 | ONE_8-15.5 36.73,18.9 ONE_8-15.6 | ONE_8-15.5 | IR_0-7.1 16.15,30.48 18.9,27.74 24.54,27.74 24.99,27.28 24.99,20.57 ONE_8-15.2 | 54.25,48.62 54.25,46.63 IR_0-7.10
HLT  (via drill 0.35)
  Top 0.152: RHLT.2 52.58,25.91 41.6,25.91 41,26.52 41,27.74 58.37,45.11 63.25,45.11 65.68,47.55 65.99,47.55 CONTROL_LOGIC_16-23.17 66.14,47.7 67.06,48.62 72.85,48.62 75.89,51.66 75.89,51.82 v83.06,58.98 | v98.3,76.81 101.96,80.47 101.96,87.63 CONTROL_LOGIC.24
  Bottom 0.152: v98.3,76.81 86.11,64.62 86.11,62.03 v83.06,58.98
INPUT  (via drill 0.35)
  Top 0.152: CONTROL_LOGIC_0-7.14 152.4,54.41 155.6,57.61 155.6,73.3 139.14,89.76 114.45,89.76 v110.8,86.11 | v74.52,23.16 75.44,23.16 77.27,21.34 122.83,21.34 131.67,30.18 132.44,30.18 134.87,32.61 v134.87,35.05
  Bottom 0.152: v110.8,86.11 97.54,86.11 96.01,87.63 CONTROL_LOGIC.18 | RINPUT.2 62.18,26.67 65.68,23.16 v74.52,23.16 | v134.87,35.05 139.9,35.05 152.4,47.55 CONTROL_LOGIC_0-7.14
IR0  (via drill 0.35)
  Top 0.152: v51.51,77.27 49.07,74.83 48.31,74.83 IR_OUT_0-7.2 48.16,74.68 44.35,70.87 11.89,70.87 5.49,64.47 5.49,49.23 6.1,48.62 6.1,42.82 17.68,31.24 17.68,30.48 IR_0-7.2
  Bottom 0.152: v51.51,77.27 61.42,77.27 61.72,76.96 67.82,76.96 82.45,62.33 82.45,54.71 R0.2
IR1  (via drill 0.35)
  Top 0.152: v67.67,66.75 67.36,67.06 55.47,67.06 50.9,71.63 50.9,74.68 IR_OUT_0-7.3 | v74.68,48.31 75.59,48.31 79.25,51.97 80.01,51.97 R1.2
  Bottom 0.152: v67.67,66.75 67.67,63.25 72.39,58.52 72.39,57 77.27,52.12 80.01,52.12 R1.2 | v74.68,48.31 74.68,47.4 70.87,43.59 62.33,43.59 52.88,34.14 49.68,34.14 44.04,28.5 42.37,28.5 39.78,25.91 39.01,25.91 37.19,27.74 33.98,27.74 32.16,25.91 28.8,25.91 25.45,29.26 25.45,30.48 IR_0-7.5
IR2  (via drill 0.35)
  Top 0.152: R2.2 80.92,58.06 80.92,60.66 84.73,64.47 84.89,64.47 86.11,65.68 86.11,68.73 76.2,78.64 58.52,78.64 54.71,74.83 53.34,74.83 IR_OUT_0-7.4 | v58.67,44.2 66.45,44.2 v69.95,47.7
  Bottom 0.152: IR_0-7.6 28.5,30.48 29.87,29.11 43.59,29.11 v58.67,44.2 | v69.95,47.7 74.22,51.97 74.83,51.97 R2.2
IR3
  Top 0.152: IR_0-7.9 36.58,30.48 43.89,37.8 50.6,37.8 59.13,46.33 64.01,46.33 65.08,47.4 65.08,48.01 69.04,51.97 69.8,51.97 R3.2
  Bottom 0.152: IR_OUT_0-7.5 55.93,74.83 56.69,74.83 58.22,76.35 63.25,76.35 64.47,75.13 64.47,70.87 66.75,68.58 66.75,59.13 69.8,56.08 69.8,52.12 R3.2
IR4
  Bottom 0.152: 63.86,53.03 63.86,73.15 61.27,75.74 60.66,75.74 59.74,74.83 58.52,74.83 IR_OUT_0-7.6 | 63.86,53.03 64.77,52.12 R4.2 | IR_0-7.12 36.58,38.1 38.25,39.78 39.17,39.78 48.77,49.38 60.2,49.38 63.86,53.03
IR5
  Top 0.152: IR_0-7.15 28.96,38.1 31.39,40.54 44.96,40.54 56.39,51.97 59.59,51.97 R5.2
  Bottom 0.152: IR_OUT_0-7.7 60.96,53.34 R5.2
IR6
  Bottom 0.152: IR_OUT_0-7.8 63.4,74.83 62.64,74.83 61.42,76.05 58.37,76.05 55.63,73.3 55.63,53.03 54.71,52.12 R6.2 54.56,51.97 53.65,51.05 48.92,51.05 38.71,40.84 35.36,40.84 34.44,39.93 28.19,39.93 26.36,38.1 IR_0-7.16
IR7  (via drill 0.35)
  Top 0.152: v55.02,68.43 58.37,68.43 64.62,74.68 65.99,74.68 IR_OUT_0-7.9 | IR_0-7.19 18.75,38.1 21.18,40.54 23.01,40.54 24.23,41.76 24.23,49.99 29.26,55.02 46.63,55.02 49.53,52.12 R7.2
  Bottom 0.152: v55.02,68.43 55.02,67.82 50.44,63.25 50.44,53.03 49.53,52.12 R7.2
IR8
  Bottom 0.152: IR_OUT_8-15.2 7.62,71.17 11.28,67.51 11.28,48.31 17.68,41.91 IR_8-15.2 17.83,41.91 19.51,40.23 32.92,40.23 34.14,41.45 34.14,42.06 44.04,51.97 44.35,51.97 R8.2
IR9  (via drill 0.35)
  Top 0.152: v12.8,72.08 10.21,74.68 IR_OUT_8-15.3 | R9.2 39.32,52.12 35.51,52.12 32.92,54.71 30.18,54.71 26.52,51.05 26.52,42.98 25.45,41.91 IR_8-15.5
  Bottom 0.152: v12.8,72.08 12.8,51.97 13.87,50.9 17.98,50.9 19.2,49.68 19.2,48.01 25.3,41.91 IR_8-15.5
IR10
  Bottom 0.152: 29.41,51.05 32.46,51.05 33.38,51.97 34.29,51.97 R10.2 | 29.41,51.05 28.96,51.05 14.94,65.08 14.94,70.87 12.8,73 12.8,74.68 IR_OUT_8-15.4 | 29.41,51.05 29.41,46.94 28.04,45.57 28.04,41.91 IR_8-15.6
IR11
  Top 0.152: IR_8-15.9 35.51,41.91 35.51,42.98 29.26,49.23 29.26,51.97 R11.2
  Bottom 0.152: IR_OUT_8-15.5 15.24,65.99 29.11,52.12 R11.2
IR12  (via drill 0.35)
  Top 0.152: v83.06,32.31 70.56,32.31 69.65,31.39 69.65,30.94 68.58,29.87 58.37,29.87 57.15,31.09 55.93,31.09 CONTROL_LOGIC_16-23.4 55.78,31.24 53.95,33.07 v53.95,37.03 | v88.54,28.5 v94.79,22.25 | IR_8-15.12 36.58,49.53 40.69,45.41 47.4,45.41 49.84,47.85 49.84,48.01 50.6,48.77 v52.27,48.77
  Bottom 0.152: R12.2 24.23,51.97 27.13,51.97 29.11,49.99 29.11,47.09 26.82,44.81 26.82,41.45 27.43,40.84 28.5,40.84 29.41,41.76 29.41,43.43 35.51,49.53 IR_8-15.12 | v83.06,32.31 84.28,32.31 86.72,29.87 88.54,29.87 | 88.54,29.87 94.03,29.87 95.25,31.09 CONTROL_LOGIC_8-15.4 | v94.79,22.25 127.86,22.25 134.57,28.96 134.57,31.09 CONTROL_LOGIC_0-7.4 | 88.54,29.87 v88.54,28.5 | v52.27,48.77 52.73,48.77 52.88,48.92 58.37,48.92 59.28,48.01 59.28,42.37 v53.95,37.03
IR13  (via drill 0.35)
  Top 0.152: v71.32,57.91 18.44,57.91 12.95,52.43 12.95,51.82 13.72,51.05 14.33,51.05 15.24,51.97 19.05,51.97 R13.2
  Bottom 0.152: R13.2 19.05,51.97 22.86,51.97 24.23,50.6 26.82,50.6 27.89,49.53 IR_8-15.15 | 54.71,31.24 53.34,31.24 CONTROL_LOGIC_16-23.3 | 54.71,31.24 60.35,36.88 72.85,36.88 | 72.85,36.88 80.16,36.88 86.87,30.18 91.75,30.18 92.66,31.09 CONTROL_LOGIC_8-15.3 | 54.71,31.24 54.71,29.11 61.27,22.55 74.83,22.55 75.13,22.86 128.02,22.86 131.98,26.82 131.98,31.09 CONTROL_LOGIC_0-7.3 | v71.32,57.91 71.32,57.45 76.2,52.58 76.2,48.92 74.98,47.7 74.98,40.08 72.85,37.95 72.85,36.88
IR14  (via drill 0.35)
  Top 0.152: v74.22,38.25 v57.91,38.25 | v118.72,25.15 93.27,25.15 90.22,28.19 90.22,31.09 CONTROL_LOGIC_8-15.2 | v73,57.3 20.12,57.3 14.94,52.12 14.02,52.12 R14.2
  Bottom 0.152: IR_8-15.16 24.84,49.53 23.77,50.6 19.2,50.6 17.83,51.97 14.02,51.97 R14.2 | v57.91,38.25 50.9,31.24 CONTROL_LOGIC_16-23.2 | 83.06,38.25 v74.22,38.25 | 83.06,38.25 90.07,31.24 CONTROL_LOGIC_8-15.2 | CONTROL_LOGIC_0-7.2 129.54,28.5 130.76,27.28 130.76,26.06 129.84,25.15 v118.72,25.15 | v73,57.3 76.5,57.3 89,44.81 89,44.2 83.06,38.25
IR15  (via drill 0.35)
  Top 0.152: v12.8,50.6 11.43,51.97 8.99,51.97 R15.2 8.84,51.97 6.55,49.68 v6.4,49.68 | v73.46,37.64 53.65,37.64 48.31,32.31 48.31,31.24 CONTROL_LOGIC_16-23.1 | CONTROL_LOGIC_8-15.1 87.63,30.33 93.42,24.54 119.94,24.54 126.49,31.09 126.95,31.09 CONTROL_LOGIC_0-7.1
  Bottom 0.152: v12.8,50.6 16.61,50.6 17.68,49.53 IR_8-15.19 | v73.46,37.64 81.23,37.64 87.63,31.24 CONTROL_LOGIC_8-15.1 | v6.4,49.68 6.4,30.63 23.77,13.26 24.54,13.26 24.99,13.72 24.99,15.39 23.16,17.22 23.16,19.51 23.47,19.81 24.84,19.81 25.76,18.9 25.76,18.59 26.36,17.98 26.98,17.98 34.59,25.6 41.91,25.6 47.4,31.09 48.16,31.09 CONTROL_LOGIC_16-23.1
IRI  (via drill 0.35)
  Top 0.152: v102.56,83.67 102.56,78.49 106.38,74.68 106.38,73.76 CLOCK_GATE.2 | v112.47,41.6 106.38,41.6 v106.07,41.3 97.38,32.61 84.28,32.61 79.25,27.58 74.68,27.58 73.76,26.67 RIRI.2
  Bottom 0.152: v102.56,83.67 102.11,83.67 100.28,85.5 96.16,85.5 94.03,87.63 CONTROL_LOGIC.16 | v112.47,41.6 137.47,41.6 143.41,47.55 144.78,47.55 CONTROL_LOGIC_0-7.17 | v106.07,41.3 106.38,41.6 106.38,48.01 105.61,48.77 105.61,71.48 106.38,72.24 106.38,73.61 CLOCK_GATE.2
IRO
  Top 0.152: NOT_GATE_2.9 135.94,59.59 135.94,59.13 108.05,31.24 CONTROL_LOGIC_8-15.9 107.9,31.24 107.14,32 99.97,32 99.36,31.39 99.36,30.79 94.34,25.76 93.57,25.76 91.75,27.58 91.75,31.24 90.68,32.31 86.72,32.31 81.08,26.67 RIRO.2
JMP  (via drill 0.35)
  Top 0.152: v137.92,55.93 137.92,64.16 136.4,65.68 130.61,65.68 129.08,67.21 128.17,67.21 NOT_GATE_2.3 | v138.68,44.65 135.48,41.45 135.48,27.43 134.72,26.67 RJMP.2 | v85.34,47.55 86.41,47.55 87.33,46.63 90.53,46.63 91.75,47.85 91.75,48.01 97.69,53.95 114.76,53.95 v123.6,62.79
  Bottom 0.152: v137.92,55.93 137.92,48.62 138.68,47.85 v138.68,44.65 | v85.34,47.55 76.2,47.55 CONTROL_LOGIC_16-23.13 | v123.6,62.79 128.02,67.21 NOT_GATE_2.3
MARI  (via drill 0.35)
  Top 0.152: v75.89,78.03 v66.14,68.28
  Bottom 0.152: CONTROL_LOGIC_16-23.16 68.58,56.84 66.14,59.28 v66.14,68.28 | 75.89,84.12 75.89,84.89 79.7,88.7 83.06,88.7 83.97,87.78 CONTROL_LOGIC.6 | 75.89,84.12 v75.89,78.03 | 75.89,84.12 74.98,84.12 74.68,84.43 74.68,86.26 81.08,92.66 135.33,92.66 156.21,71.78 156.21,33.68 149.96,27.43 149.96,26.67 RMARI.2
MBRI
  Bottom 0.152: 96.77,24.84 90.83,24.84 89,26.67 RMBRI.2 | 96.77,24.84 110.03,24.84 112.93,27.74 112.93,31.09 CONTROL_LOGIC_8-15.11 | 96.77,24.84 96.77,67.36 103.94,74.52 106.53,74.52 107.44,75.44 107.44,76.96 101.8,82.6 85.65,82.6 80.62,87.63 80.01,87.63 CONTROL_LOGIC.2
MBRO
  Top 0.152: NOT_GATE_2.5 128.02,62.18 128.02,60.81 115.67,48.46 115.67,47.7 CONTROL_LOGIC_8-15.13 115.52,47.55 115.52,43.74 112.78,41 108.51,41 99.06,31.55 99.06,31.09 94.64,26.67 RMBRO.2
MCR  (via drill 0.35)
  Top 0.152: v123.6,23.93 134.26,34.59 134.26,35.66 v134.87,36.27
  Bottom 0.152: NOT_GATE_1.3 146,67.21 146.76,67.21 147.98,65.99 154.38,65.99 154.99,65.38 154.99,51.97 150.72,47.7 150.72,47.24 150.11,46.63 148.28,46.63 147.37,47.55 CONTROL_LOGIC_0-7.16 147.22,47.55 135.94,36.27 v134.87,36.27 | RMCR.2 72.39,26.67 75.13,23.93 v123.6,23.93
N$1  (via drill 0.35)
  Top 0.152: v104.55,68.43 100.58,72.39 MICROCODE_COUNTER.14 | v70.26,35.36 98.3,35.36 103.48,40.54 v104.39,40.54 | v129.54,33.22 119.02,33.22 115.98,30.18 106.38,30.18 105.46,31.09 CONTROL_LOGIC_8-15.8
  Bottom 0.152: 104.55,40.54 104.55,32 105.31,31.24 CONTROL_LOGIC_8-15.8 | 104.55,40.54 v104.55,68.43 | v70.26,35.36 66.14,31.24 CONTROL_LOGIC_16-23.8 | 104.55,40.54 v104.39,40.54 | v129.54,33.22 141.43,33.22 143.41,31.24 144.78,31.24 CONTROL_LOGIC_0-7.8
N$2  (via drill 0.35)
  Top 0.152: v99.67,35.81 98.6,34.75 67.97,34.75 64.47,31.24 63.55,31.24 CONTROL_LOGIC_16-23.7 | v128.78,32.61 118.87,32.61 116.13,29.87 104.09,29.87 102.87,31.09 CONTROL_LOGIC_8-15.7
  Bottom 0.152: 101.96,35.81 101.96,32.16 102.87,31.24 CONTROL_LOGIC_8-15.7 | 101.96,35.81 101.96,64.62 99.52,67.06 99.52,67.67 100.43,68.58 100.43,69.8 MICROCODE_COUNTER.13 | 101.96,35.81 v99.67,35.81 | v128.78,32.61 139.45,32.61 140.82,31.24 142.19,31.24 CONTROL_LOGIC_0-7.7
N$3  (via drill 0.35)
  Top 0.152: v96.16,26.67 96.16,26.98 100.28,31.09 CONTROL_LOGIC_8-15.6 100.43,31.09 101.96,29.57 108.97,29.57 112.78,25.76 v120.24,25.76
  Bottom 0.152: MICROCODE_COUNTER.12 100.58,67.21 100.58,66.45 103.78,63.25 103.78,30.79 103.17,30.18 101.35,30.18 100.43,31.09 CONTROL_LOGIC_8-15.6 | v96.16,26.67 94.94,27.89 86.56,27.89 77.88,36.58 67.67,36.58 62.33,31.24 60.96,31.24 CONTROL_LOGIC_16-23.6 | v120.24,25.76 130,25.76 130.45,26.21 130.45,27.13 128.63,28.96 128.63,31.55 129.08,32 137.62,32 138.38,31.24 139.6,31.24 CONTROL_LOGIC_0-7.6
N$4  (via drill 0.35)
  Top 0.152: v97.38,33.53 67.21,33.53 63.86,30.18 60.66,30.18 59.74,31.09 58.52,31.09 CONTROL_LOGIC_16-23.5 | CONTROL_LOGIC_0-7.5 137.16,33.38 v136.09,34.44
  Bottom 0.152: 98.75,33.53 98.75,32.16 97.84,31.24 CONTROL_LOGIC_8-15.5 97.84,31.09 97.84,26.52 99.21,25.15 109.88,25.15 111.71,26.98 111.71,31.09 112.62,32 113.39,32 114,31.39 114,30.79 113.39,30.18 113.39,26.21 113.84,25.76 114.76,25.76 123.44,34.44 v136.09,34.44 | 98.75,33.53 98.75,61.72 100.43,63.4 100.43,64.77 MICROCODE_COUNTER.11 | 98.75,33.53 v97.38,33.53
N$5
  Top 0.152: LEDINPUT.A 58.52,15.24 58.52,19.05 RINPUT.1
N$6
  Top 0.152: LEDONE.A 63.55,15.24 63.55,19.05 RONE.1
N$7
  Top 0.152: RMCR.1 LEDMCR.A
N$8
  Top 0.152: LEDIRI.A 73.76,15.24 73.76,19.05 RIRI.1
N$9
  Top 0.152: LEDIRO.A 78.79,15.24 78.79,19.05 RIRO.1
N$10
  Top 0.152: ROI.1 LEDOI.A
N$11
  Top 0.152: LEDMBRI.A 89,15.24 89,19.05 RMBRI.1
N$12
  Top 0.152: RALUO.1 LEDALUO.A
N$13
  Top 0.152: LEDSU.A 104.24,15.24 104.24,19.05 RSU.1
N$14
  Top 0.152: LEDSC.A 109.27,15.24 109.27,19.05 RSC.1
N$15
  Top 0.152: LEDCO.A 124.51,15.24 124.51,19.05 RCO.1
N$16
  Top 0.152: LEDJMP.A 134.72,15.24 134.72,19.05 RJMP.1
N$17
  Top 0.152: LEDRO.A 139.75,15.24 139.75,19.05 RRO.1
N$18
  Top 0.152: RRI.1 LEDRI.A
N$19
  Top 0.152: LEDMARI.A 149.96,15.24 149.96,19.05 RMARI.1
N$20
  Top 0.152: LEDMBRO.A 94.03,15.24 94.03,19.05 RMBRO.1
N$21
  Top 0.152: RACO.1 LEDACO.A
N$22
  Top 0.152: LEDACI.A 119.48,15.24 119.48,19.05 RACI.1
N$23
  Top 0.152: RCE.1 LEDCE.A
N$24
  Top 0.152: RHLT.1 LEDHLT.A
N$25
  Top 0.152: LED1.A R1.1
N$26
  Top 0.152: R2.1 74.98,59.74 74.98,63.4 LED2.A
N$27
  Top 0.152: R3.1 69.95,59.74 69.95,63.4 LED3.A
N$28
  Top 0.152: LED4.A R4.1
N$29
  Top 0.152: R5.1 59.74,59.74 59.74,63.4 LED5.A
N$30
  Top 0.152: R6.1 54.71,59.74 54.71,63.4 LED6.A
N$31
  Top 0.152: LED7.A R7.1
N$32
  Top 0.152: R8.1 44.5,59.74 44.5,63.4 LED8.A
N$33  (via drill 0.35)
  Top 0.152: v89,73.3 100.89,73.3 103.02,71.17 106.38,71.17 CLOCK_GATE.3 | v80.77,65.08 80.31,65.08 75.89,60.66 75.89,59.28 69.65,53.03 63.86,53.03 | 63.86,53.03 51.82,53.03 49.07,50.29 38.86,50.29 IR_8-15.11 | IR_0-7.11 50.44,38.1 58.98,46.63 63.86,46.63 64.47,47.24 64.47,51.05 63.86,51.66 63.86,53.03
  Bottom 0.152: v80.77,65.08 v89,73.3
N$34
  Top 0.152: R9.1 39.47,59.74 39.47,63.4 LED9.A
N$35
  Top 0.152: LED10.A R10.1
N$36
  Top 0.152: R11.1 29.26,59.74 29.26,63.4 LED11.A
N$37
  Top 0.152: R12.1 24.23,59.74 24.23,63.4 LED12.A
N$38
  Top 0.152: LED13.A R13.1
N$39
  Top 0.152: R14.1 14.02,59.74 14.02,63.4 LED14.A
N$40
  Top 0.152: R15.1 8.99,59.74 8.99,63.4 LED15.A
N$41
  Top 0.152: R0.1 85.19,59.74 85.19,63.4 LED0.A
N$42
  Top 0.152: LED15.K 8.99,66.14 13.87,66.14 LED14.K 14.02,66.14 19.05,66.14 | 34.29,66.14 29.26,66.14 LED11.K 29.11,66.14 24.23,66.14 LED12.K 24.08,66.14 19.05,66.14 | 19.05,66.14 LED13.K | 80.01,66.14 74.98,66.14 LED2.K 74.83,66.14 69.95,66.14 LED3.K 69.8,66.14 64.77,66.14 | 80.01,66.14 85.04,66.14 LED0.K | 80.01,66.14 LED1.K | 49.53,66.14 44.5,66.14 LED8.K 44.35,66.14 39.47,66.14 LED9.K 39.32,66.14 34.29,66.14 | 64.77,66.14 59.74,66.14 LED5.K 59.59,66.14 54.71,66.14 LED6.K 54.56,66.14 49.53,66.14 | 49.53,66.14 LED7.K | 64.77,66.14 LED4.K | 34.29,66.14 LED10.K
OI  (via drill 0.35)
  Top 0.152: v109.73,27.89 98.3,27.89 95.86,25.45 93.42,25.45 91.14,27.74 91.14,31.39 90.53,32 86.87,32 83.82,28.96 ROI.2 | v108.36,75.13 108.36,82.75 102.41,88.7 101.65,88.7 100.74,87.78 100.13,87.78 CONTROL_LOGIC.22
  Bottom 0.152: CONTROL_LOGIC_8-15.10 110.49,28.65 v109.73,27.89 110.19,27.43 110.19,26.36 109.58,25.76 108.81,25.76 106.98,27.58 106.98,48.01 108.36,49.38 v108.36,75.13
ONE  (via drill 0.35)
  Top 0.152: v148.74,60.35 148.74,68.28 146,71.02 146,72.39 NOT_GATE_1.1 | v128.78,24.54 138.84,24.54 141.28,26.98 v141.28,42.82
  Bottom 0.152: 148.74,48.77 v148.74,60.35 | 148.74,48.77 149.81,47.7 CONTROL_LOGIC_0-7.15 | RONE.2 67.21,26.67 70.1,23.77 74.83,23.77 75.29,23.32 127.56,23.32 v128.78,24.54 | v141.28,42.82 147.22,48.77 148.74,48.77
RI  (via drill 0.35)
  Top 0.152: v144.32,53.8 144.32,48.46 143.87,48.01 143.87,27.58 RRI.2 | v83.52,54.56 79.25,54.56 72.39,47.7 71.17,47.7 CONTROL_LOGIC_16-23.15 | v114,54.56 v92.05,54.56
  Bottom 0.152: 146.76,63.09 146.76,61.87 144.32,59.44 v144.32,53.8 | 146.76,63.09 146.76,65.23 146.3,65.68 145.24,65.68 141.12,69.8 136.09,69.8 NOT_GATE_2.13 | v92.05,54.56 v83.52,54.56 | v114,54.56 114.45,54.56 118.57,58.67 131.22,58.67 135.64,63.09 146.76,63.09
RO  (via drill 0.35)
  Top 0.152: v137.31,55.17 137.31,62.64 136.09,63.86 136.09,64.77 NOT_GATE_2.11 | v138.07,43.13 138.07,28.19 139.6,26.67 RRO.2 | v76.81,44.5 73.76,47.55 CONTROL_LOGIC_16-23.14 | v88.39,44.5 100.74,44.5 103.33,41.91 111.86,41.91 v113.08,43.13
  Bottom 0.152: v137.31,55.17 137.31,48.77 138.07,48.01 v138.07,43.13 v113.08,43.13 | v88.39,44.5 v76.81,44.5
SC
  Bottom 0.152: NOT_GATE_1.5 145.85,62.18 137.31,62.18 133.5,58.37 118.72,58.37 108.05,47.7 CONTROL_LOGIC_8-15.16 108.05,47.55 109.12,46.48 109.12,26.67 RSC.2
SU
  Bottom 0.152: CONTROL_LOGIC_8-15.15 110.49,43.43 109.88,42.82 109.88,33.07 111.4,31.55 111.4,27.13 109.73,25.45 106.68,25.45 | 106.68,25.45 105.46,25.45 104.24,26.67 RSU.2 | 106.68,25.45 106.68,48.16 107.75,49.23 107.75,77.11 101.96,82.91 89.46,82.91 85.04,87.33 85.04,88.09 85.95,89 94.18,89 95.25,90.07 95.86,90.07 CONTROL_LOGIC.17
VCC  (via drill 0.35)
  Top 0.152: ONE_0-7.20 24.23,14.02 24.23,8.69 26.67,6.25 ONE_0-7.2 | CONTROL_LOGIC_16-23.21 55.78,47.7 53.34,47.7 CONTROL_LOGIC_16-23.22 | IR_OUT_0-7.20 45.72,82.6 44.81,82.6 41.76,79.55 8.23,79.55 5.18,82.6 IR_OUT_8-15.20 | C3.2 9.45,43.89 | 9.45,43.89 IR_0-7.20 v13.72,36.58 | IR_8-15.20 9.6,43.89 9.45,43.89 | CONTROL_LOGIC_8-15.24 87.63,47.7 90.07,47.7 CONTROL_LOGIC_8-15.23 90.22,47.7 90.22,59.89 92.51,62.18 MICROCODE_COUNTER.7 | MICROCODE_COUNTER.9 100.58,59.74 100.58,62.18 MICROCODE_COUNTER.10 100.43,62.18 92.66,62.18 MICROCODE_COUNTER.7 | BUS.19 62.48,89.76 71.17,89.76 91.59,69.34 91.59,63.25 92.51,62.33 MICROCODE_COUNTER.7 | CONTROL_LOGIC_0-7.24 127.1,47.7 128.02,48.62 132.44,48.62 133.35,47.7 134.57,47.7 CONTROL_LOGIC_0-7.21 134.72,47.7 134.72,51.66 138.53,55.47 138.53,73.3 | NOT_GATE_2.1 NOT_GATE_2.14 136.09,72.39 137.01,73.3 138.53,73.3 | NOT_GATE_1.14 147.52,72.39 146.61,73.3 138.53,73.3 | CLOCK_GATE.14 110.34,76.2 106.83,72.69 106.22,72.69 101.5,77.42 100.58,77.42 MICROCODE_COUNTER.16 | v53.19,83.97 55.93,83.97 58.37,81.53 v58.52,81.53
  Bottom 0.152: ONE_0-7.20 24.08,14.17 22.86,15.39 22.86,19.66 24.08,20.88 24.08,26.82 ONE_8-15.20 24.08,26.98 16.61,26.98 10.67,32.92 | 10.67,32.92 7.62,32.92 C4.2 | CONTROL_LOGIC_16-23.22 53.34,47.55 52.43,46.63 50.44,46.63 49.53,47.55 48.31,47.55 CONTROL_LOGIC_16-23.24 48.16,47.55 48.16,46.18 33.53,31.55 32.46,31.55 31.55,30.63 31.55,30.02 30.94,29.41 30.02,29.41 29.11,30.33 29.11,30.94 25.91,34.14 20.57,34.14 17.68,37.03 16.31,37.03 IR_0-7.20 | C3.2 7.62,51.05 4.12,54.56 4.12,79.55 5.03,80.47 5.03,82.6 IR_OUT_8-15.20 | 10.67,32.92 10.67,33.53 v13.72,36.58 | CONTROL_LOGIC_8-15.21 95.25,47.55 93.88,47.55 92.96,46.63 91.14,46.63 90.22,47.55 CONTROL_LOGIC_8-15.23 | C2.2 126.95,48.31 126.95,47.7 CONTROL_LOGIC_0-7.24 | C1.2 100.43,78.64 100.43,77.57 MICROCODE_COUNTER.16 100.43,77.42 100.43,76.5 91.59,67.67 91.59,64.47 92.51,63.55 92.51,62.33 MICROCODE_COUNTER.7 | CLOCK_GATE.14 124.21,76.2 128.02,72.39 NOT_GATE_2.1 | v53.19,83.97 47.85,83.97 46.63,82.75 45.72,82.75 IR_OUT_0-7.20 | v58.52,81.53 61.57,81.53 62.18,82.14 62.18,86.11 61.42,86.87 61.42,88.85 62.33,89.76 BUS.19

## Text on the board
bNames: MARIE PC / Instruction Register / Architecture design by: Dr. Linda Null / Hardware implementation by: Richard Bowser